# EAGLE schematic schema-int-project-signal-position-0V (EAGLE 9.6.2)
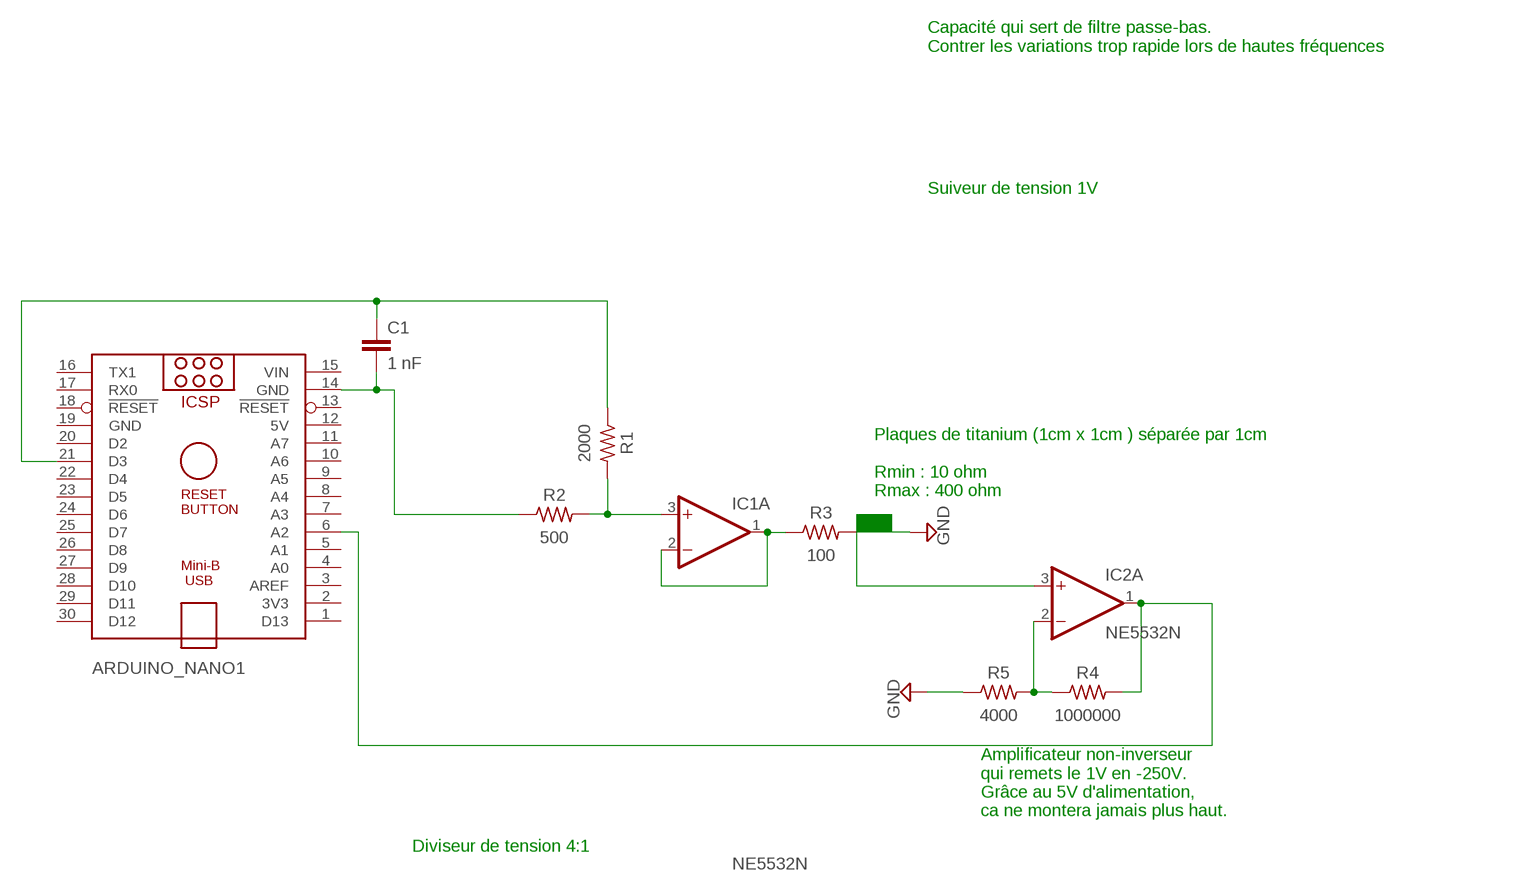
[diagram p0: schematic, sheet 1]

## Parts
ARDUINO_NANO1  ARDUINO_NANO  [ARDUINO_NANO]
C1  1 nF  C2,5-3  [C2.5-3]
IC1  NE5532N  [DIL08]
IC2  NE5532N  [DIL08]
R1  2000  R-US_AXIAL-7.2MM-PITCH  [RESAD724W46L381D178B]
R2  500  R-US_AXIAL-7.2MM-PITCH  [RESAD724W46L381D178B]
R3  100  R-US_AXIAL-7.2MM-PITCH  [RESAD724W46L381D178B]
R4  1000000  R-US_AXIAL-7.2MM-PITCH  [RESAD724W46L381D178B]
R5  4000  R-US_AXIAL-7.2MM-PITCH  [RESAD724W46L381D178B]

## Nets
GND: R5.1
N$1: ARDUINO_NANO1.14(GND) C1.2 R2.1
N$2: IC1.3(A:+IN) R1.2 R2.2
N$3: IC1.1(A:OUT) IC1.2(A:-IN) R3.1
N$4: ARDUINO_NANO1.6(A2) IC2.1(A:OUT) R4.2
N$5: IC2.2(A:-IN) R4.1 R5.2
N$7: IC2.3(A:+IN) R3.2
N$10: ARDUINO_NANO1.21(D3) C1.1 R1.1
Unconnected: ARDUINO_NANO1.1(D13) ARDUINO_NANO1.2(3V3) ARDUINO_NANO1.3(AREF) ARDUINO_NANO1.4(A0) ARDUINO_NANO1.5(A1) ARDUINO_NANO1.7(A3) ARDUINO_NANO1.8(A4) ARDUINO_NANO1.9(A5) ARDUINO_NANO1.10(A6) ARDUINO_NANO1.11(A7) ARDUINO_NANO1.13(!RESET) ARDUINO_NANO1.16(TX1) ARDUINO_NANO1.17(RX0) ARDUINO_NANO1.18(!RESET) ARDUINO_NANO1.20(D2) ARDUINO_NANO1.22(D4) ARDUINO_NANO1.23(D5) ARDUINO_NANO1.24(D6) ARDUINO_NANO1.25(D7) ARDUINO_NANO1.26(D8) ARDUINO_NANO1.27(D9) ARDUINO_NANO1.28(D10) ARDUINO_NANO1.29(D11) ARDUINO_NANO1.30(D12) IC1.5(B:+IN) IC1.6(B:-IN) IC1.7(B:OUT) IC2.5(B:+IN) IC2.6(B:-IN) IC2.7(B:OUT)

## Notes on the sheet
- Capacité qui sert de filtre passe-bas. 
  Contrer les variations trop rapide lors de hautes fréquences
- Suiveur de tension 1V
- Plaques de titanium (1cm x 1cm ) séparée par 1cm
  
  Rmin : 10 ohm
  Rmax : 400 ohm
- Amplificateur non-inverseur 
  qui remets le 1V en -250V. 
  Grâce au 5V d'alimentation, 
  ca ne montera jamais plus haut.
- Diviseur de tension 4:1

## Power pins joined to a net without a drawn wire
5V: ARDUINO_NANO1.12(5V)
GND: ARDUINO_NANO1.19(GND)
V+: IC1.8(P:V+) IC2.8(P:V+)
V-: IC1.4(P:V-) IC2.4(P:V-)
VIN: ARDUINO_NANO1.15(VIN)

## Library data of the parts
ARDUINO_NANO1 = ArduinoNanoV30:ARDUINO_NANO: Arduino Nano V3.0 Overview: The Arduino Nano is a small, complete, and breadboard-friendly board based on the ATmega328 (Arduino Nano 3.x) or ATmega168 (Arduino Nano 2.x). It has more or less the same functionality of the Arduino Duemilanove, but in a different package. It lacks only a DC power jack, and works with a Mini-B USB cable instead of a standard one. The Nano was designed and is being produced by Gravitech. Specifications: Microcontroller Atmel ATmega168 or ATmega328 Operating Voltage (logic level) 5 V Input Voltage (recommended) 7-12 V Input Voltage (limits) 6-20 V Digital I/O Pins 14 (of which 6 provide PWM output) Analog Input Pins 8 DC Current per I/O Pin 40 mA Flash Memory 16 KB (ATmega168) or 32 KB (ATmega328) of which 2 KB used by bootloader SRAM 1 KB (ATmega168) or 2 KB (ATmega328) EEPROM 512 bytes (ATmega168) or 1 KB (ATmega328) Clock Speed 16 MHz Dimensions 0.73" x 1.70" Length 45 mm Width 18 mm Weigth 5 g Power: The Arduino Nano can be powered via the Mini-B USB connection, 6-20V unregulated external power supply (pin 30), or 5V regulated external power supply (pin 27). The power source is automatically selected to the highest voltage source. Memory: The ATmega168 has 16 KB of flash memory for storing code (of which 2 KB is used for the bootloader); the ATmega328 has 32 KB, (also with 2 KB used for the bootloader). The ATmega168 has 1 KB of SRAM and 512 bytes of EEPROM (which can be read and written with the EEPROM library); the ATmega328 has 2 KB of SRAM and 1 KB of EEPROM. Input and Output: Each of the 14 digital pins on the Nano can be used as an input or output, using pinMode(), digitalWrite(), and digitalRead() functions. They operate at 5 volts. Each pin can provide or receive a maximum of 40 mA and has an internal pull-up resistor (disconnected by default) of 20-50 kOhms. In addition, some pins have specialized functions. Visit Arduino - ArduinoBoardNano <https://www.arduino.cc/en/Main/ArduinoBoardNano>
C1 = capacitor-wima:C: CAPACITOR naming: grid - package width
IC1 IC2 = linear:NE5532: AUDIO AMPLIFIER
R1-R5 = Resistor:R-US: Resistor Fixed - ANSI; CATEGORY: Resistor; SUB-CATEGORY: Fixed